# EAGLE design temp-stellwerk-laser-4 (EAGLE 9.6.2)
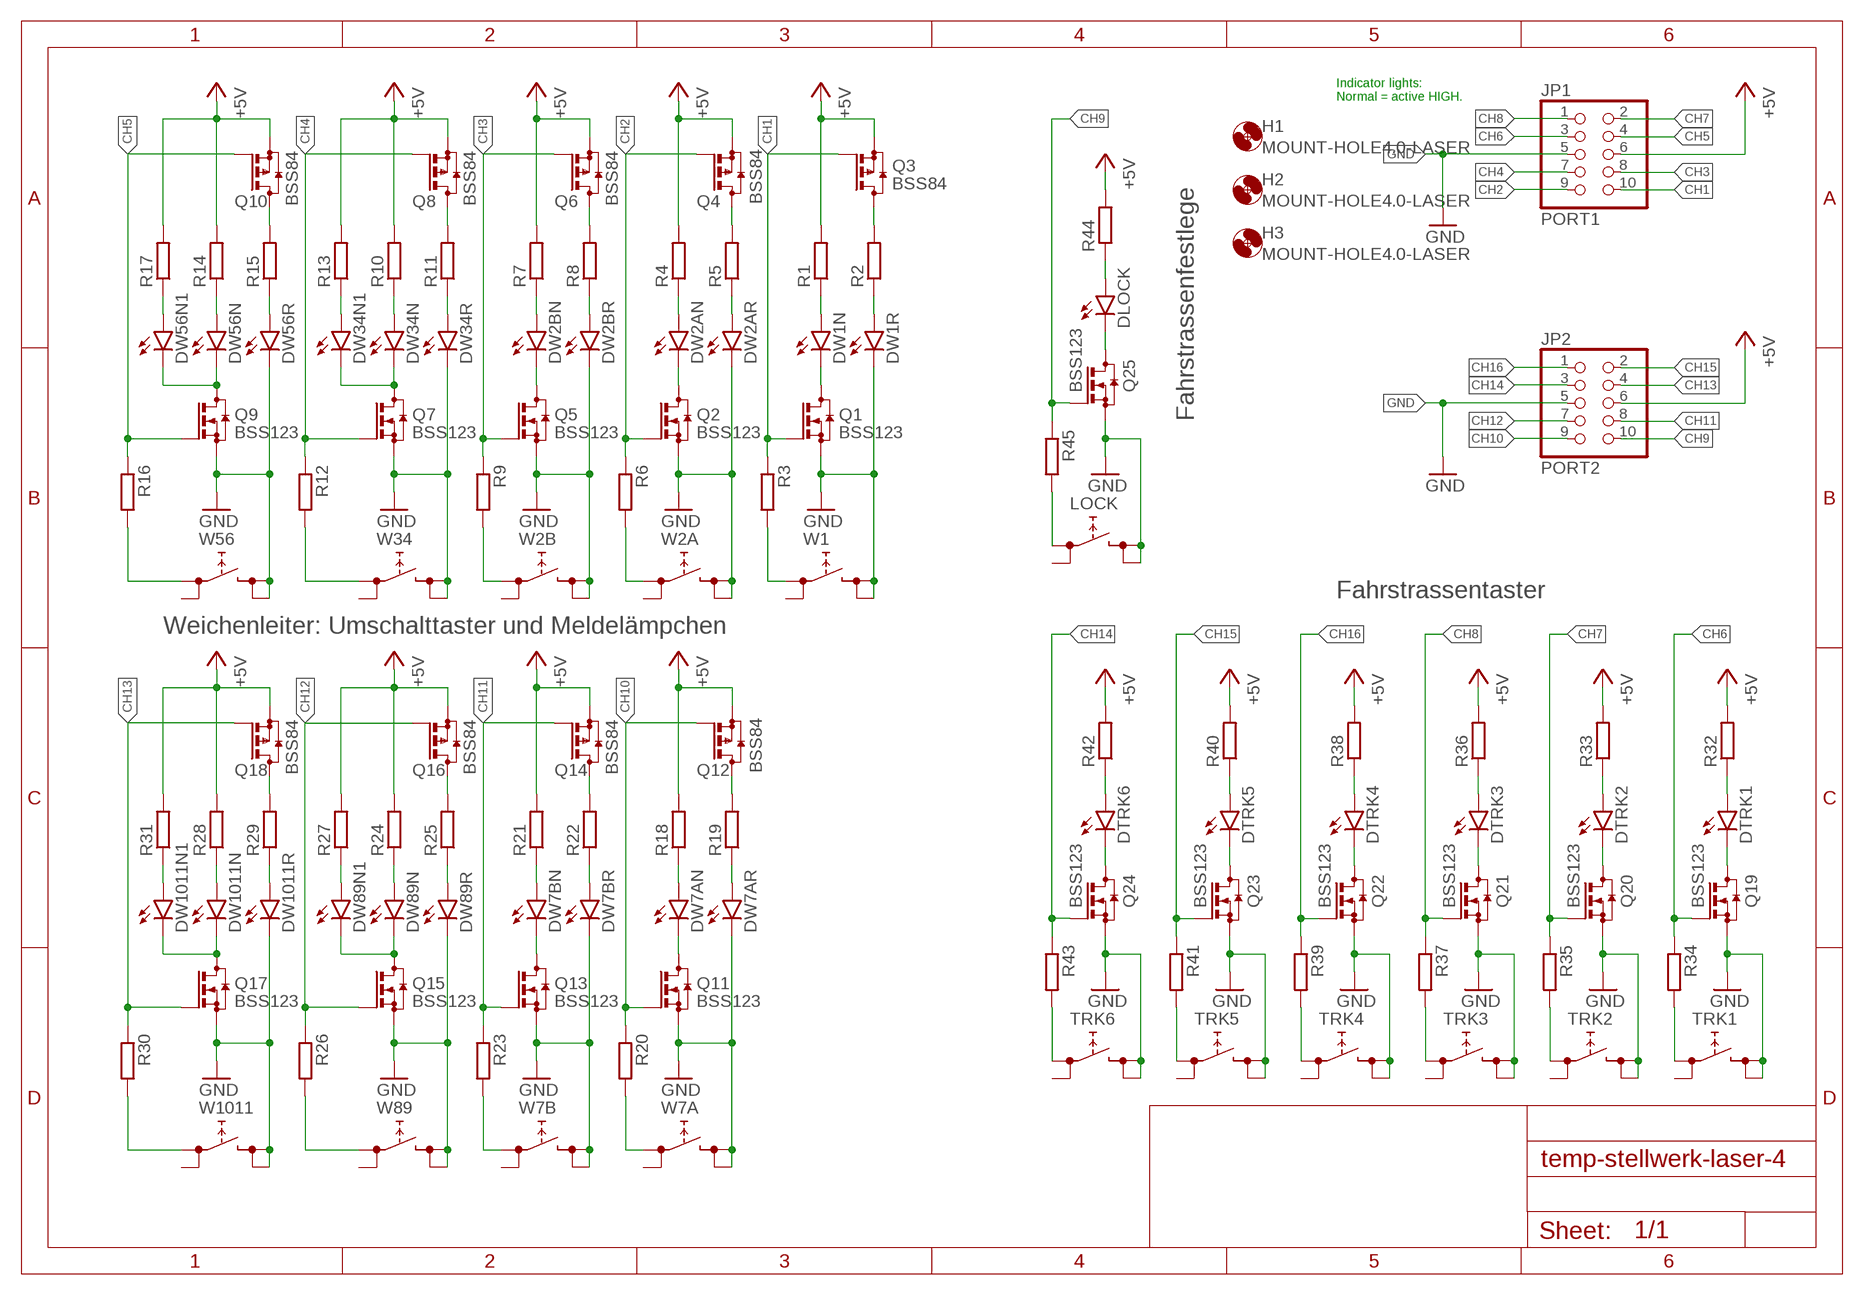
[diagram p0: schematic, sheet 1]

## Parts
DLOCK  LEDCHIPLED_0805  [CHIPLED_0805]
DTRK1  LEDCHIPLED_0805  [CHIPLED_0805]
DTRK2  LEDCHIPLED_0805  [CHIPLED_0805]
DTRK3  LEDCHIPLED_0805  [CHIPLED_0805]
DTRK4  LEDCHIPLED_0805  [CHIPLED_0805]
DTRK5  LEDCHIPLED_0805  [CHIPLED_0805]
DTRK6  LEDCHIPLED_0805  [CHIPLED_0805]
DW1N  LEDCHIPLED_0603  [CHIPLED_0603]
DW1R  LEDCHIPLED_0603  [CHIPLED_0603]
DW2AN  LEDCHIPLED_0603  [CHIPLED_0603]
DW2AR  LEDCHIPLED_0603  [CHIPLED_0603]
DW2BN  LEDCHIPLED_0805  [CHIPLED_0805]
DW2BR  LEDCHIPLED_0805  [CHIPLED_0805]
DW7AN  LEDCHIPLED_0603  [CHIPLED_0603]
DW7AR  LEDCHIPLED_0603  [CHIPLED_0603]
DW7BN  LEDCHIPLED_0805  [CHIPLED_0805]
DW7BR  LEDCHIPLED_0805  [CHIPLED_0805]
DW34N  LEDCHIPLED_0805  [CHIPLED_0805]
DW34N1  LEDCHIPLED_0805  [CHIPLED_0805]
DW34R  LEDCHIPLED_0805  [CHIPLED_0805]
DW56N  LEDCHIPLED_0805  [CHIPLED_0805]
DW56N1  LEDCHIPLED_0805  [CHIPLED_0805]
DW56R  LEDCHIPLED_0805  [CHIPLED_0805]
DW89N  LEDCHIPLED_0805  [CHIPLED_0805]
DW89N1  LEDCHIPLED_0805  [CHIPLED_0805]
DW89R  LEDCHIPLED_0805  [CHIPLED_0805]
DW1011N  LEDCHIPLED_0805  [CHIPLED_0805]
DW1011N1  LEDCHIPLED_0805  [CHIPLED_0805]
DW1011R  LEDCHIPLED_0805  [CHIPLED_0805]
H1  MOUNT-HOLE4.0-LASER  [MOUNT-HOLE-3.2-4.0-LASER]
H2  MOUNT-HOLE4.0-LASER  [MOUNT-HOLE-3.2-4.0-LASER]
H3  MOUNT-HOLE4.0-LASER  [MOUNT-HOLE-3.2-4.0-LASER]
JP1  PORT1  PINHD-2X5CN  [CON10M]
JP2  PORT2  PINHD-2X5CN  [CON10M]
LOCK  LOCK  TACTSW-6X6S  [TACTSW-6X6-LASER]
Q1  BSS123  [SOT23-NCH]
Q2  BSS123  [SOT23-NCH]
Q3  BSS84  [SOT23]
Q4  BSS84  [SOT23]
Q5  BSS123  [SOT23-NCH]
Q6  BSS84  [SOT23]
Q7  BSS123  [SOT23-NCH]
Q8  BSS84  [SOT23]
Q9  BSS123  [SOT23-NCH]
Q10  BSS84  [SOT23]
Q11  BSS123  [SOT23-NCH]
Q12  BSS84  [SOT23]
Q13  BSS123  [SOT23-NCH]
Q14  BSS84  [SOT23]
Q15  BSS123  [SOT23-NCH]
Q16  BSS84  [SOT23]
Q17  BSS123  [SOT23-NCH]
Q18  BSS84  [SOT23]
Q19  BSS123  [SOT23-NCH]
Q20  BSS123  [SOT23-NCH]
Q21  BSS123  [SOT23-NCH]
Q22  BSS123  [SOT23-NCH]
Q23  BSS123  [SOT23-NCH]
Q24  BSS123  [SOT23-NCH]
Q25  BSS123  [SOT23-NCH]
R1  R-EU_R0805  [R0805]
R2  R-EU_R0805  [R0805]
R3  R-EU_R0805  [R0805]
R4  R-EU_R0805  [R0805]
R5  R-EU_R0805  [R0805]
R6  R-EU_R0805  [R0805]
R7  R-EU_R0805  [R0805]
R8  R-EU_R0805  [R0805]
R9  R-EU_R0805  [R0805]
R10  R-EU_R0805  [R0805]
R11  R-EU_R0805  [R0805]
R12  R-EU_R0805  [R0805]
R13  R-EU_R0805  [R0805]
R14  R-EU_R0805  [R0805]
R15  R-EU_R0805  [R0805]
R16  R-EU_R0805  [R0805]
R17  R-EU_R0805  [R0805]
R18  R-EU_R0805  [R0805]
R19  R-EU_R0805  [R0805]
R20  R-EU_R0805  [R0805]
R21  R-EU_R0805  [R0805]
R22  R-EU_R0805  [R0805]
R23  R-EU_R0805  [R0805]
R24  R-EU_R0805  [R0805]
R25  R-EU_R0805  [R0805]
R26  R-EU_R0805  [R0805]
R27  R-EU_R0805  [R0805]
R28  R-EU_R0805  [R0805]
R29  R-EU_R0805  [R0805]
R30  R-EU_R0805  [R0805]
R31  R-EU_R0805  [R0805]
R32  R-EU_R0805  [R0805]
R33  R-EU_R0805  [R0805]
R34  R-EU_R0805  [R0805]
R35  R-EU_R0805  [R0805]
R36  R-EU_R0805  [R0805]
R37  R-EU_R0805  [R0805]
R38  R-EU_R0805  [R0805]
R39  R-EU_R0805  [R0805]
R40  R-EU_R0805  [R0805]
R41  R-EU_R0805  [R0805]
R42  R-EU_R0805  [R0805]
R43  R-EU_R0805  [R0805]
R44  R-EU_R0805  [R0805]
R45  R-EU_R0805  [R0805]
TRK1  TACTSW-6X6S  [TACTSW-6X6-LASER]
TRK2  TACTSW-6X6S  [TACTSW-6X6-LASER]
TRK3  TACTSW-6X6S  [TACTSW-6X6-LASER]
TRK4  TACTSW-6X6S  [TACTSW-6X6-LASER]
TRK5  TACTSW-6X6S  [TACTSW-6X6-LASER]
TRK6  TACTSW-6X6S  [TACTSW-6X6-LASER]
W1  W1  TACTSW-6X6S  [TACTSW-6X6-LASER]
W2A  TACTSW-6X6S  [TACTSW-6X6-LASER]
W2B  TACTSW-6X6S  [TACTSW-6X6-LASER]
W7A  TACTSW-6X6S  [TACTSW-6X6-LASER]
W7B  TACTSW-6X6S  [TACTSW-6X6-LASER]
W34  XOVER  TACTSW-6X6S  [TACTSW-6X6-LASER]
W56  XOVER  TACTSW-6X6S  [TACTSW-6X6-LASER]
W89  XOVER  TACTSW-6X6S  [TACTSW-6X6-LASER]
W1011  XOVER  TACTSW-6X6S  [TACTSW-6X6-LASER]

## Nets
+5V: JP1.6 JP2.6 Q3.2(S) Q4.2(S) Q6.2(S) Q8.2(S) Q10.2(S) Q12.2(S) Q14.2(S) Q16.2(S) Q18.2(S) R1.2 R4.2 R7.2 R10.2 R13.2 R14.2 R17.2 R18.2 R21.2 R24.2 R27.2 R28.2 R31.2 R32.2 R33.2 R36.2 R38.2 R40.2 R42.2 R44.2
CH1: JP1.10 Q1.1(G) Q3.1(G) R3.1
CH2: JP1.9 Q2.1(G) Q4.1(G) R6.1
CH3: JP1.8 Q5.1(G) Q6.1(G) R9.1
CH4: JP1.7 Q7.1(G) Q8.1(G) R12.1
CH5: JP1.4 Q9.1(G) Q10.1(G) R16.1
CH6: JP1.3 Q19.1(G) R34.1
CH7: JP1.2 Q20.1(G) R35.1
CH8: JP1.1 Q21.1(G) R37.1
CH9: JP2.10 Q25.1(G) R45.1
CH10: JP2.9 Q11.1(G) Q12.1(G) R20.1
CH11: JP2.8 Q13.1(G) Q14.1(G) R23.1
CH12: JP2.7 Q15.1(G) Q16.1(G) R26.1
CH13: JP2.4 Q17.1(G) Q18.1(G) R30.1
CH14: JP2.3 Q24.1(G) R43.1
CH15: JP2.2 Q23.1(G) R41.1
CH16: JP2.1 Q22.1(G) R39.1
GND: DW1R.C DW2AR.C DW2BR.C DW7AR.C DW7BR.C DW34R.C DW56R.C DW89R.C DW1011R.C JP1.5 JP2.5 LOCK.3(2.1) LOCK.4(2.2) Q1.2(S) Q2.2(S) Q5.2(S) Q7.2(S) Q9.2(S) Q11.2(S) Q13.2(S) Q15.2(S) Q17.2(S) Q19.2(S) Q20.2(S) Q21.2(S) Q22.2(S) Q23.2(S) Q24.2(S) Q25.2(S) TRK1.3(2.1) TRK1.4(2.2) TRK2.3(2.1) TRK2.4(2.2) TRK3.3(2.1) TRK3.4(2.2) TRK4.3(2.1) TRK4.4(2.2) TRK5.3(2.1) TRK5.4(2.2) TRK6.3(2.1) TRK6.4(2.2) W1.3(2.1) W1.4(2.2) W2A.3(2.1) W2A.4(2.2) W2B.3(2.1) W2B.4(2.2) W7A.3(2.1) W7A.4(2.2) W7B.3(2.1) W7B.4(2.2) W34.3(2.1) W34.4(2.2) W56.3(2.1) W56.4(2.2) W89.3(2.1) W89.4(2.2) W1011.3(2.1) W1011.4(2.2)
N$1: DTRK1.C Q19.3(D)
N$2: DW1N.C Q1.3(D)
N$3: DW1N.A R1.1
N$4: DW1R.A R2.1
N$5: Q3.3(D) R2.2
N$6: DW2AN.C Q2.3(D)
N$8: R3.2 W1.1(1.1)
N$9: DW2AN.A R4.1
N$10: DW2AR.A R5.1
N$11: Q4.3(D) R5.2
N$13: R6.2 W2A.1(1.1)
N$14: DW2BN.C Q5.3(D)
N$15: DW2BN.A R7.1
N$16: DW2BR.A R8.1
N$17: Q6.3(D) R8.2
N$19: R9.2 W2B.1(1.1)
N$20: DW56N.A R14.1
N$21: DW34N.A R10.1
N$22: DW34R.A R11.1
N$23: Q8.3(D) R11.2
N$25: R12.2 W34.1(1.1)
N$26: DW34N1.C DW34N.C Q7.3(D)
N$27: DW34N1.A R13.1
N$28: DW56R.A R15.1
N$29: Q10.3(D) R15.2
N$31: R16.2 W56.1(1.1)
N$32: DW56N1.C DW56N.C Q9.3(D)
N$33: DW56N1.A R17.1
N$34: DW7AN.C Q11.3(D)
N$35: DW7AN.A R18.1
N$36: DW7AR.A R19.1
N$37: Q12.3(D) R19.2
N$39: R20.2 W7A.1(1.1)
N$40: DW7BN.C Q13.3(D)
N$41: DW7BN.A R21.1
N$42: DW7BR.A R22.1
N$43: Q14.3(D) R22.2
N$45: R23.2 W7B.1(1.1)
N$46: DW89N.A R24.1
N$47: DW89R.A R25.1
N$48: Q16.3(D) R25.2
N$50: R26.2 W89.1(1.1)
N$51: DW89N1.C DW89N.C Q15.3(D)
N$52: DW89N1.A R27.1
N$53: DW1011N.A R28.1
N$54: DW1011R.A R29.1
N$55: Q18.3(D) R29.2
N$57: R30.2 W1011.1(1.1)
N$58: DW1011N1.C DW1011N.C Q17.3(D)
N$59: DW1011N1.A R31.1
N$60: DTRK1.A R32.1
N$61: DTRK2.C Q20.3(D)
N$62: DTRK2.A R33.1
N$64: R34.2 TRK1.1(1.1)
N$66: R35.2 TRK2.1(1.1)
N$67: DTRK3.C Q21.3(D)
N$68: DTRK3.A R36.1
N$70: R37.2 TRK3.1(1.1)
N$71: DTRK4.C Q22.3(D)
N$72: DTRK4.A R38.1
N$74: R39.2 TRK4.1(1.1)
N$75: DTRK5.C Q23.3(D)
N$76: DTRK5.A R40.1
N$78: R41.2 TRK5.1(1.1)
N$79: DTRK6.C Q24.3(D)
N$80: DTRK6.A R42.1
N$82: R43.2 TRK6.1(1.1)
N$83: DLOCK.C Q25.3(D)
N$84: DLOCK.A R44.1
N$86: LOCK.1(1.1) R45.2
Unconnected: LOCK.2(1.2) TRK1.2(1.2) TRK2.2(1.2) TRK3.2(1.2) TRK4.2(1.2) TRK5.2(1.2) TRK6.2(1.2) W1.2(1.2) W2A.2(1.2) W2B.2(1.2) W7A.2(1.2) W7B.2(1.2) W34.2(1.2) W56.2(1.2) W89.2(1.2) W1011.2(1.2)

## Notes on the sheet
- Indicator lights:
  Normal = active HIGH.
- Fahrstrassenfestlege
- Fahrstrassentaster
- Weichenleiter: Umschalttaster und Meldelämpchen

## Library data of the parts
DLOCK DTRK1-DTRK6 DW1N DW1R DW2AN DW2AR DW2BN DW2BR DW7AN DW7AR DW7BN DW7BR DW34N DW34N1 DW34R DW56N DW56N1 DW56R DW89N DW89N1 DW89R DW1011N DW1011N1 DW1011R = eagleparts:LED: LED OSRAM: - CHIPLED LG R971, LG N971, LY N971, LG Q971, LY Q971, LO R971, LY R971 LH N974, LH R974 LS Q976, LO Q976, LY Q976 LO Q996 - Hyper CHIPLED LW Q18S LB Q993, LB Q99A, LB R99A - SideLED LS A670, LO A670, LY A670, LG A670, LP A670 LB A673, LV A673, LT A673, LW A673 LH A674 LY A675 LS A676, LA A676, LO A676, LY A676, LW A676 LS A679, LY A679, LG A679 - Hyper Micro SIDELED® LS Y876, LA Y876, LO Y876, LY Y876 LT Y87S - SmartLED LW L88C, LW L88S LB L89C, LB L89S, LG L890 LS L89K, LO L89K, LY L89K LS L896, LA L896, LO L896, LY L896 - TOPLED LS T670, LO T670, LY T670, LG T670, LP T670 LSG T670, LSP T670, LSY T670, LOP T670, LYG T670 LG T671, LOG T671, LSG T671 LB T673, LV T673, LT T673, LW T673 LH T674 LS T676, LA T676, LO T676, LY T676, LB T676, LH T676, LSB T676, LW T676 LB T67C, LV T67C, LT T67C, LS T67K, LO T67K, LY T67K, LW E67C LS E67B, LA E67B, LO E67B, LY E67B, LB E67C, LV E67C, LT E67C LW T67C LS T679, LY T679, LG T679 LS T770, LO T770, LY T770, LG T770, LP T770 LB T773, LV T773, LT T773, LW T773 LH T774 LS E675, LA E675, LY E675, LS T675 LS T776, LA T776, LO T776, LY T776, LB T776 LHGB T686 LT T68C, LB T68C - Hyper Mini TOPLED® LB M676 - Mini TOPLED Santana® LG M470 LS M47K, LO M47K, LY M47K Source: http://www.osram.convergy.de LUXEON: - LUMILED® LXK2-PW12-R00, LXK2-PW12-S00, LXK2-PW14-U00, LXK2-PW14-V00 LXK2-PM12-R00, LXK2-PM12-S00, LXK2-PM14-U00 LXK2-PE12-Q00, LXK2-PE12-R00, LXK2-PE12-S00, LXK2-PE14-T00, LXK2-PE14-U00 LXK2-PB12-K00, LXK2-PB12-L00, LXK2-PB12-M00, LXK2-PB14-N00, LXK2-PB14-P00, LXK2-PB14-Q00 LXK2-PR12-L00, LXK2-PR12-M00, LXK2-PR14-Q00, LXK2-PR14-R00 LXK2-PD12-Q00, LXK2-PD12-R00, LXK2-PD12-S00 LXK2-PH12-R00, LXK2-PH12-S00 LXK2-PL12-P00, LXK2-PL12-Q00, LXK2-PL12-R00 Source: www.luxeon.com KINGBRIGHT: KA-3528ASYC Source: www.kingbright.com
H1-H3 = eagleparts:MOUNT-HOLE
JP1 JP2 = trainlib:PINHD-2X5: PIN HEADER
LOCK TRK1-TRK6 W1 W2A W2B W7A W7B W34 W56 W89 W1011 = eagleparts:TACTSW-6X6: 6.2 X 6.5mm TACT Switch (SMD) Source: http://www3.alps.co.jp/WebObjects/catalog.woa/PDF/E/Switch/Tact/SKHM/SKHM.PDF
Q1 Q2 Q5 Q7 Q9 Q11 Q13 Q15 Q17 Q19-Q25 = eagleparts:BSS123: N-CHANNEL MOS FET
Q3 Q4 Q6 Q8 Q10 Q12 Q14 Q16 Q18 = transistor-small-signal:BSS84: P-CHANNEL MOS FET
R1-R45 = rcl:R-EU_: RESISTOR, European symbol; SPICEPREFIX: R

## Net classes
0 default: width 0.254 mm, clearance 0.203 mm

## Board
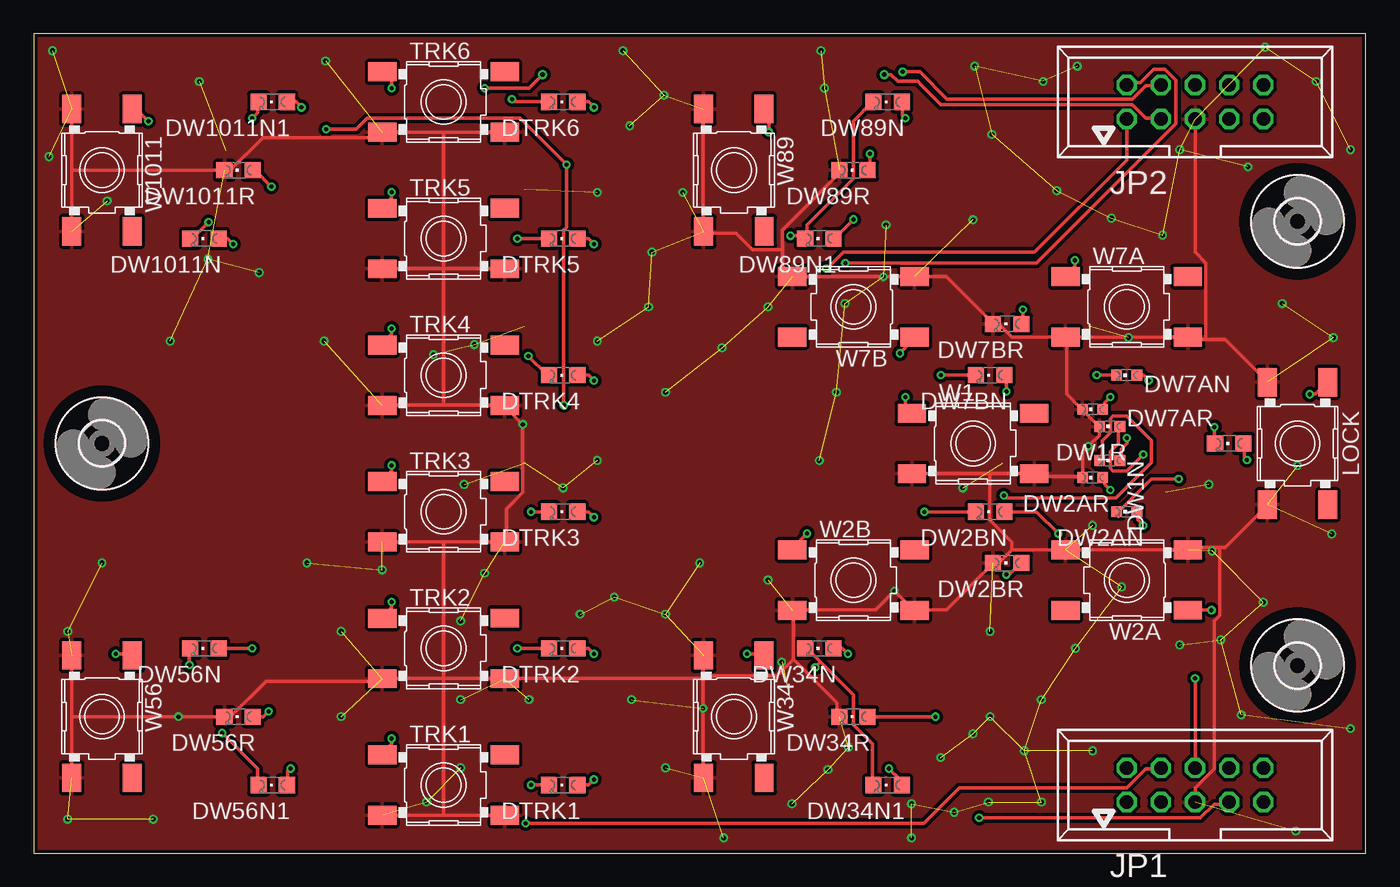
[diagram p1: board, top side]
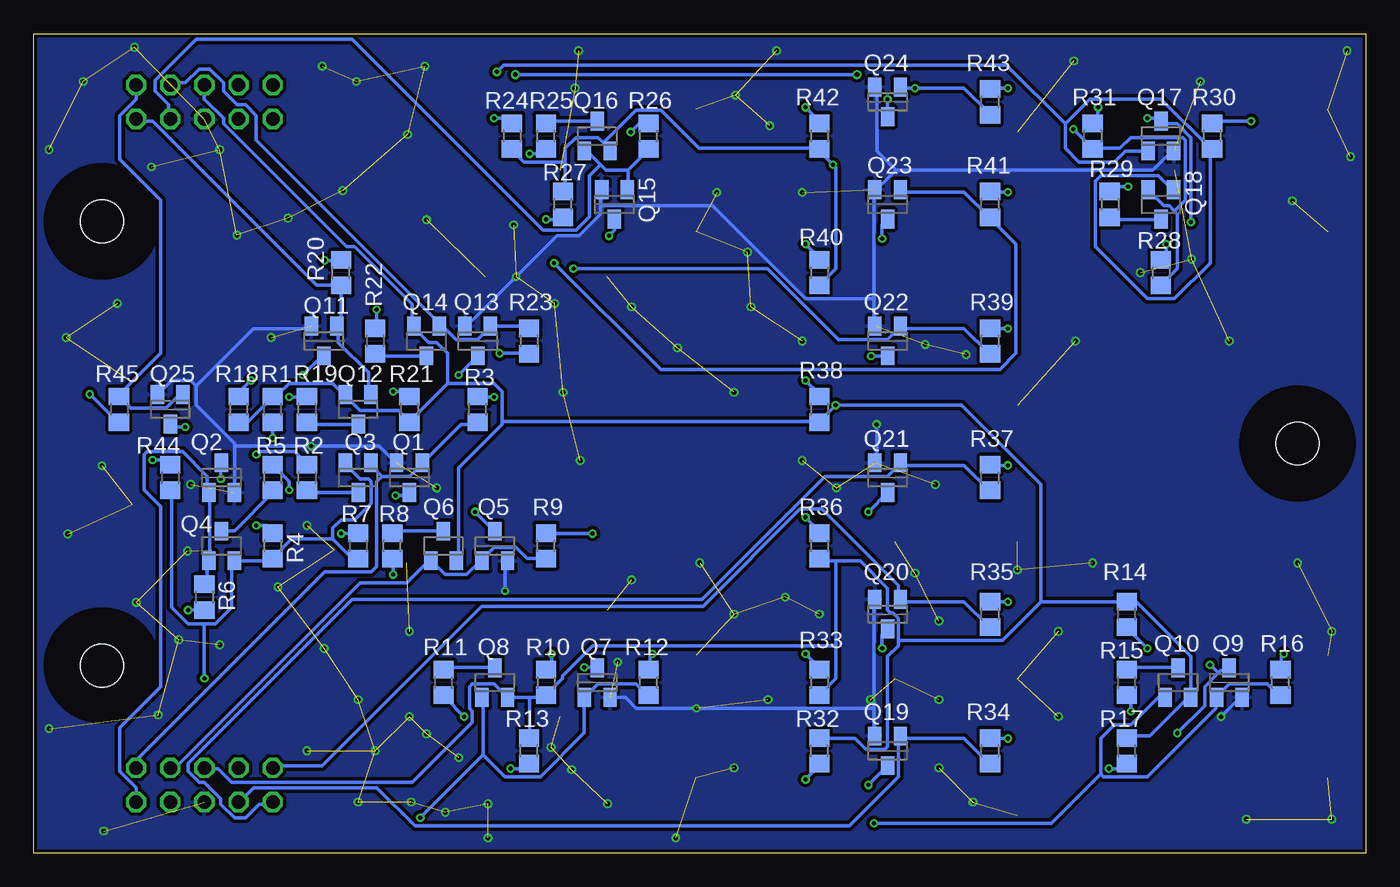
[diagram p2: board, bottom side, seen from below]

Size 99.06 x 60.96 mm. Coordinates in mm from the lower left corner, seen from the top.
Outline: 0,0 99.06,0 99.06,60.96 0,60.96 0,0
Copper layers (1*16): Top 0.035mm / dielectric 1.5mm / Bottom 0.035mm
Design rules "Fusion_eagle_rule_v1.1": minimum track width 6mil, minimum drill 12mil, track to track 6mil, track to pad 6mil, pad to pad 6mil, via to via 6mil, smd to smd 0mil, copper to edge 10mil, drill to drill 10mil, minimum pad ring 10mil, minimum via ring 6mil, stop-mask expansion 2mil, vias tented up to drill 100mil, thermal gap 10mil

### Footprints (pad centres in the part's own frame; a part is rotated, then mirrored left to right if it is on the bottom)
CHIPLED_0805 = smd 1.2 x 1.2: A 0,-1.05; C 0,1.05
CHIPLED_0603 = smd 0.8 x 0.8: A 0,-0.75; C 0,0.75
MOUNT-HOLE-3.2-4.0-LASER = hole 3.2: 0,0
CON10M = drill 1 octagon: 1 -5.08,-1.27; 2 -5.08,1.27; 3 -2.54,-1.27; 4 -2.54,1.27; 5 0,-1.27; 6 0,1.27; 7 2.54,-1.27; 8 2.54,1.27; 9 5.08,-1.27; 10 5.08,1.27
TACTSW-6X6-LASER = smd 2.1 x 1.4: 1 -4.55,2.24; 2 4.55,2.25; 3 -4.55,-2.25; 4 4.55,-2.25
SOT23-NCH = smd 1 x 1.4: 1 -0.95,-1.1; 2 0.95,-1.1; 3 0,1.1
SOT23 = smd 1 x 1.4: 1 -0.95,-1.1; 2 0.95,-1.1; 3 0,1.1
R0805 = smd 1.3 x 1.5: 1 -0.95,0; 2 0.95,0

### Placement (x,y rotation side)
DLOCK  88.9,30.48 90 top
DTRK1  39.37,5.08 90 top
DTRK2  39.37,15.24 90 top
DTRK3  39.37,25.4 90 top
DTRK4  39.37,35.56 90 top
DTRK5  39.37,45.72 90 top
DTRK6  39.37,55.88 90 top
DW1N  80.01,29.21 90 top
DW1R  80.01,31.75 90 top
DW2AN  81.28,25.4 90 top
DW2AR  78.74,27.94 90 top
DW2BN  71.12,25.4 90 top
DW2BR  72.39,21.59 90 top
DW7AN  81.28,35.56 90 top
DW7AR  78.74,33.02 90 top
DW7BN  71.12,35.56 90 top
DW7BR  72.39,39.37 90 top
DW34N  58.42,15.24 90 top
DW34N1  63.5,5.08 90 top
DW34R  60.96,10.16 90 top
DW56N  12.7,15.24 90 top
DW56N1  17.78,5.08 90 top
DW56R  15.24,10.16 90 top
DW89N  63.5,55.88 90 top
DW89N1  58.42,45.72 90 top
DW89R  60.96,50.8 90 top
DW1011N  12.7,45.72 90 top
DW1011N1  17.78,55.88 90 top
DW1011R  15.24,50.8 90 top
H1  93.98,46.99 0 top
H2  93.98,13.97 0 top
H3  5.08,30.48 0 top
JP1  86.36,5.08 0 top
JP2  86.36,55.88 0 top
LOCK  93.98,30.48 270 top
Q1  71.12,27.94 180 bottom
Q2  85.09,27.94 0 bottom
Q3  74.93,27.94 180 bottom
Q4  85.09,22.86 0 bottom
Q5  64.77,22.86 0 bottom
Q6  68.58,22.86 0 bottom
Q7  57.15,12.7 0 bottom
Q8  64.77,12.7 0 bottom
Q9  10.16,12.7 0 bottom
Q10  13.97,12.7 0 bottom
Q11  77.47,38.1 180 bottom
Q12  74.93,33.02 180 bottom
Q13  66.04,38.1 180 bottom
Q14  69.85,38.1 180 bottom
Q15  55.88,48.26 180 bottom
Q16  57.15,53.34 0 bottom
Q17  15.24,53.34 0 bottom
Q18  15.24,48.26 180 bottom
Q19  35.56,7.62 180 bottom
Q20  35.56,17.78 180 bottom
Q21  35.56,27.94 180 bottom
Q22  35.56,38.1 180 bottom
Q23  35.56,48.26 180 bottom
Q24  35.56,55.88 180 bottom
Q25  88.9,33.02 180 bottom
R1  81.28,33.02 90 bottom
R2  78.74,27.94 270 bottom
R3  66.04,33.02 90 bottom
R4  81.28,22.86 270 bottom
R5  81.28,27.94 270 bottom
R6  86.36,19.05 270 bottom
R7  74.93,22.86 270 bottom
R8  72.39,22.86 90 bottom
R9  60.96,22.86 90 bottom
R10  60.96,12.7 270 bottom
R11  68.58,12.7 90 bottom
R12  53.34,12.7 90 bottom
R13  62.23,7.62 90 bottom
R14  17.78,17.78 90 bottom
R15  17.78,12.7 90 bottom
R16  6.35,12.7 90 bottom
R17  17.78,7.62 90 bottom
R18  83.82,33.02 270 bottom
R19  78.74,33.02 270 bottom
R20  76.2,43.18 90 bottom
R21  71.12,33.02 270 bottom
R22  73.66,38.1 270 bottom
R23  62.23,38.1 270 bottom
R24  63.5,53.34 270 bottom
R25  60.96,53.34 90 bottom
R26  53.34,53.34 90 bottom
R27  59.69,48.26 90 bottom
R28  15.24,43.18 270 bottom
R29  19.05,48.26 270 bottom
R30  11.43,53.34 90 bottom
R31  20.32,53.34 270 bottom
R32  40.64,7.62 90 bottom
R33  40.64,12.7 270 bottom
R34  27.94,7.62 90 bottom
R35  27.94,17.78 90 bottom
R36  40.64,22.86 270 bottom
R37  27.94,27.94 90 bottom
R38  40.64,33.02 270 bottom
R39  27.94,38.1 90 bottom
R40  40.64,43.18 270 bottom
R41  27.94,48.26 90 bottom
R42  40.64,53.34 270 bottom
R43  27.94,55.88 90 bottom
R44  88.9,27.94 270 bottom
R45  92.71,33.02 270 bottom
TRK1  30.48,5.08 0 top
TRK2  30.48,15.24 0 top
TRK3  30.48,25.4 0 top
TRK4  30.48,35.56 0 top
TRK5  30.48,45.72 0 top
TRK6  30.48,55.88 0 top
W1  69.85,30.48 0 top
W2A  81.28,20.32 180 top
W2B  60.96,20.32 0 top
W7A  81.28,40.64 0 top
W7B  60.96,40.64 180 top
W34  52.07,10.16 270 top
W56  5.08,10.16 270 top
W89  52.07,50.8 270 top
W1011  5.08,50.8 270 top

### Tracks (layer width: path | path; a pad name or v marks a point on that pad's centre or on a via)
+5V  (via drill 0.3)
  Top 0.254: JP1.6 v86.36,13.01 | v21.74,53.85 23.98,53.85 24.79,54.66 36.17,54.66 v39.62,51.21 39.62,46.53 39.42,46.33 v39.42,33.33
  Bottom 0.254: R17.2 17.68,8.74 16.05,8.74 13.21,11.58 Q10.2 13.01,11.79 13.01,14.63 17.07,18.69 17.68,18.69 R14.2 17.88,18.69 24.18,18.69 | 34.75,15.85 34.75,17.48 35.15,17.88 35.36,17.88 35.56,18.09 35.56,19.71 37.59,21.74 39.42,21.74 | 34.75,15.85 34.75,15.44 35.56,14.63 35.56,7.92 35.76,7.72 37.19,7.72 38,8.53 40.64,8.53 R32.2 | 39.42,21.74 40.64,21.74 R36.2 | 39.42,21.74 39.42,15.44 | 39.42,15.44 39.42,13.01 40.64,11.79 R33.2 | 24.18,18.69 27.03,15.85 34.75,15.85 | 76.81,23.37 76.81,24.18 76.2,24.79 75.18,24.79 73.97,26.01 73.97,27.64 74.17,27.84 74.78,27.84 75.79,28.85 Q3.2 | 76.81,23.37 75.39,21.95 74.98,21.95 R7.2 | 86.36,17.07 85.55,17.07 84.33,18.29 84.33,21.74 Q4.2 84.12,21.74 81.28,21.74 R4.2 81.28,21.95 79.86,23.37 76.81,23.37 | 86.36,17.07 87.58,17.07 88.8,18.29 88.8,26.82 R44.2 | 62.18,11.58 60.96,11.58 R10.2 60.96,11.79 59.74,13.01 59.74,13.21 57.51,15.44 39.42,15.44 | 62.18,11.58 63.8,11.58 Q8.2 64.01,11.79 64.82,12.6 66.45,12.6 66.65,12.39 66.65,10.77 66.45,10.57 66.45,9.75 70.92,5.28 84.33,5.28 85.34,6.3 86.36,6.3 JP1.6 | 62.18,11.58 62.18,8.74 R13.2 | v86.36,13.01 86.36,17.07 | 14.22,47.75 14.02,47.55 14.02,43.48 15.24,42.27 R28.2 | 14.22,47.75 14.63,48.16 15.04,48.16 16.05,49.17 Q18.2 | 20.32,52.43 18.29,52.43 17.48,53.24 13.61,53.24 13.41,53.03 13.41,48.56 14.22,47.75 | R40.2 40.64,42.27 39.42,43.48 39.42,51 v39.62,51.21 40.64,52.22 R42.2 40.64,52.43 49.58,52.43 52.43,55.27 54.25,55.27 56.69,52.83 | 56.69,52.83 57.1,53.24 58.73,53.24 59.54,52.43 59.54,51.41 | 56.69,52.83 56.29,52.43 Q16.2 56.69,52.83 | 59.54,51.41 59.54,49.38 R27.2
  Bottom 0.254: 59.54,51.41 62.59,51.41 63.4,52.22 R24.2 | v21.74,53.85 20.32,52.43 | 20.32,52.43 R31.2 | R18.2 83.72,32.11 83.11,32.11 81.28,33.93 R1.2 81.28,34.14 80.87,34.14 80.06,34.95 76.81,34.95 76,34.14 Q12.2 75.79,33.93 74.78,32.92 71.93,32.92 71.12,32.11 | 64.21,32.11 64.21,34.34 64.82,34.95 68.28,34.95 | 64.21,32.11 64.21,31.9 67.46,28.65 67.46,21.95 Q6.2 | 71.12,32.11 68.28,34.95 | 71.12,32.11 R21.2 | 68.28,34.95 68.28,37.19 69.09,38 69.7,38 70.71,39.01 Q14.2 70.92,39.22 70.92,40.84 75.18,45.11 75.79,45.11 84.94,54.25 84.94,54.66 86.36,56.08 JP2.6 | 64.21,32.11 40.64,32.11 | 40.64,32.11 v39.42,33.33 30.07,33.33 24.18,27.43 24.18,18.69 | 40.64,32.11 R38.2
CH1
  Bottom 0.254: 73.15,28.04 71.12,28.04 70.31,28.85 Q1.1 70.1,29.06 67.26,31.9 66.04,31.9 R3.1 | 73.15,28.04 73.97,28.85 Q3.1 | JP1.10 91.44,6.91 77.42,20.93 73.97,20.93 73.56,21.34 73.56,27.64 73.15,28.04
CH2
  Bottom 0.254: R6.1 86.36,20.12 86.16,20.32 86.16,21.74 Q4.1 85.95,21.95 85.95,26.82 Q2.1 86.16,27.03 86.16,28.04 87.99,29.87 90.63,29.87 90.83,29.67 90.83,27.03 89.61,25.81 89.61,12.39 92.66,9.35 92.66,6.1 91.44,4.88 JP1.9
CH3
  Bottom 0.254: R9.1 60.96,21.95 62.38,21.95 63.2,22.76 64.82,22.76 65.63,21.95 Q5.1 65.84,21.74 66.85,20.73 68.48,20.73 69.49,21.74 Q6.1 69.7,21.74 71.32,20.12 74.78,20.12 88.39,6.5 88.8,6.5 JP1.8
CH4  (via drill 0.3)
  Top 0.254: v70.31,2.64 86.77,2.64 87.78,3.66 88.8,3.66 JP1.7
  Bottom 0.254: R12.1 53.44,11.79 54.25,12.6 57.1,12.6 57.91,11.79 Q7.1 58.12,11.58 58.12,8.94 61.37,5.69 64.01,5.69 65.63,7.32 | 65.63,7.32 65.63,11.58 Q8.1 | 65.63,7.32 v70.31,2.64
CH5  (via drill 0.3)
  Top 0.254: v36.58,2.23 66.19,2.23 68.83,4.88 81.28,4.88 82.7,6.3 83.72,6.3 JP1.4
  Bottom 0.254: R16.1 6.5,11.79 7.32,12.6 10.16,12.6 10.97,11.79 Q9.1 11.18,11.58 11.18,10.77 16.26,5.69 19.51,5.69 19.71,5.89 | 19.71,5.89 19.71,8.53 18.69,9.55 17.48,9.55 15.44,11.58 15.04,11.58 Q10.1 | v36.58,2.23 23.37,2.23 19.71,5.89
CH6
  Bottom 0.254: R34.1 28.04,6.71 29.87,8.53 34.54,8.53 Q19.1 34.75,8.53 34.75,5.69 38.41,2.03 70.71,2.03 73.56,4.88 82.7,4.88 83.72,3.86 JP1.3
CH7
  Bottom 0.254: R35.1 28.04,16.87 29.87,18.69 34.54,18.69 Q20.1 34.75,18.9 34.75,19.91 40.44,25.6 42.06,25.6 49.3,18.36 65.76,18.36 77.62,6.5 81.28,6.5 JP1.2
CH8
  Bottom 0.254: R37.1 28.04,27.03 29.87,28.85 34.54,28.85 Q21.1 34.75,28.85 35.56,28.04 40.23,28.04 49.38,18.9 75.39,18.9 87.58,6.71 87.58,6.1 86.77,5.28 86.36,5.28 85.14,4.06 85.14,3.66 84.12,2.64 83.31,2.64 82.3,3.66 81.28,3.66 JP1.1
CH9
  Bottom 0.254: Q25.1 87.99,33.93 88.39,33.93 89.2,33.12 91.85,33.12 92.66,33.93 R45.1 92.66,34.14 89.61,37.19 89.61,48.56 92.66,51.61 92.66,54.86 91.44,56.08 JP2.10
CH10
  Bottom 0.254: Q12.1 74.17,34.14 74.17,35.76 76.4,38 76.4,39.01 Q11.1 76.4,39.22 76.2,39.42 R20.1 76.2,42.27 78.03,42.27 90.22,54.46 91.44,54.46 JP2.9
CH11
  Bottom 0.254: R23.1 62.38,39.22 65.02,39.22 Q13.1 65.23,39.01 66.04,38.2 67.67,38.2 68.48,39.01 68.89,39.01 Q14.1 69.09,39.22 69.09,39.62 82.5,53.03 82.5,54.86 83.31,55.68 83.92,55.68 84.94,56.69 84.94,57.3 85.95,58.32 86.77,58.32 87.78,57.3 88.8,57.3 JP2.8
CH12
  Bottom 0.254: 54.86,50.8 54.86,49.38 Q15.1 | 54.86,50.8 53.44,52.22 R26.1 | 56.9,51.21 56.49,50.8 54.86,50.8 | 56.9,51.21 57.91,52.22 Q16.1 | 56.9,51.21 57.71,50.39 57.71,47.35 58.73,46.33 61.16,46.33 75.39,60.55 86.97,60.55 90.02,57.51 90.02,56.69 89,55.68 89,54.66 JP2.7
CH13  (via drill 0.3)
  Top 0.254: v64.62,58.12 65.89,58.12 67.92,56.08 81.69,56.08 82.7,57.1 83.72,57.1 JP2.4
  Bottom 0.254: Q18.1 14.43,49.38 15.44,50.39 19.71,50.39 20.12,49.99 20.12,45.11 16.26,41.25 14.22,41.25 11.58,43.89 11.58,52.22 R30.1 11.58,52.43 15.24,56.08 20.52,56.08 22.35,54.25 | 22.35,54.25 22.35,52.43 21.34,51.41 18.69,51.41 17.88,52.22 16.26,52.22 Q17.1 | v64.62,58.12 64.11,58.62 26.72,58.62 22.35,54.25
CH14  (via drill 0.3, 0.35)
  Top 0.254: v33.53,56.9 36.83,56.9 v37.85,57.91 | JP2.3 83.72,54.66 82.7,54.66 81.69,55.68 67.46,55.68 65.99,57.15 65.76,57.4 64.26,57.4 63.75,57.91 v63.25,57.91
  Bottom 0.254: Q24.1 34.54,56.9 v33.53,56.9 29.87,56.9 28.04,55.07 R43.1 | v63.25,57.91 v37.85,57.91
CH15  (via drill 0.3)
  Top 0.254: v60.35,43.89 74.57,43.89 84.94,54.25 84.94,57.51 84.12,58.32 83.31,58.32 82.3,57.3 81.28,57.3 JP2.2
  Bottom 0.254: Q23.1 34.54,49.17 29.87,49.17 28.04,47.35 R41.1 27.84,47.14 26.01,45.31 26.01,37.19 27.23,35.97 52.43,35.97 v60.35,43.89
CH16  (via drill 0.3)
  Top 0.254: 81.28,54.46 JP2.1 81.28,51.56 74.42,44.7 60.2,44.7 58.98,43.48 v58.93,43.48
  Bottom 0.254: R39.1 28.04,37.19 29.87,39.01 34.54,39.01 Q22.1 34.75,39.01 35.56,38.2 39.22,38.2 44.5,43.48 v58.93,43.48
GND  (via drill 0.3, 0.35)  (99 unrouted)
  Top 0.254: 2.85,50.8 2.85,55.27 W1011.3 | 2.85,50.8 2.85,46.33 W1011.4 | 30.48,43.48 34.95,43.48 TRK5.4 | 30.48,43.48 26.01,43.48 TRK5.3 | 30.48,53.65 26.01,53.65 TRK6.3 25.81,53.44 25.6,53.24 17.07,53.24 14.63,50.8 DW1011R.C 2.85,50.8 | 30.48,53.65 34.95,53.65 TRK6.4 | 30.48,53.65 30.48,43.48 | 30.48,23.16 34.95,23.16 TRK3.4 35.15,23.16 35.15,25.6 36.37,26.82 v36.37,31.9 35.15,33.12 TRK4.4 34.95,33.33 30.48,33.33 | 30.48,23.16 26.01,23.16 TRK3.3 | 30.48,33.33 26.01,33.33 TRK4.3 | 2.85,10.16 2.85,14.63 W56.3 | 2.85,10.16 2.85,5.69 W56.4 | 30.48,2.85 34.95,2.85 TRK1.4 | 30.48,2.85 26.01,2.85 TRK1.3 | 30.48,13.01 26.01,13.01 TRK2.3 25.81,12.8 17.27,12.8 14.63,10.16 DW56R.C v10.77,10.16 2.85,10.16 | 30.48,13.01 34.95,13.01 TRK2.4 35.15,13.01 49.78,13.01 | 30.48,13.01 30.48,2.85 | 30.48,13.01 30.48,23.16 | 30.48,33.33 30.48,43.48 | 88.19,22.76 88.59,22.76 91.64,25.81 LOCK.4 | 88.19,22.76 85.95,22.76 W2A.3 85.75,22.55 76.81,22.55 W2A.4 76.61,22.55 72.75,22.55 | JP1.5 86.36,4.88 87.78,6.3 87.78,17.27 88.19,17.68 88.19,22.76 | 87.17,38.2 88.59,38.2 91.64,35.15 LOCK.3 | 87.17,38.2 85.95,38.2 W7A.4 85.75,38.41 76.81,38.41 W7A.3 | JP2.5 86.36,44.7 87.17,43.89 87.17,38.2 | 55.68,44.91 55.68,43.69 56.29,43.08 W7B.4 56.49,42.88 v63.2,42.88 65.43,42.88 W7B.3 65.63,42.88 67.87,42.88 71.32,39.42 DW7BR.C 71.53,39.22 71.93,39.22 72.75,38.41 76.61,38.41 W7A.3 | 55.68,44.91 55.68,46.33 59.74,50.39 59.74,50.8 DW89R.C | 55.68,44.91 53.44,44.91 52.22,46.13 49.99,46.13 W89.4 49.78,46.33 49.78,55.27 W89.3 | 49.78,13.21 49.78,14.63 W34.3 | 49.78,13.21 49.78,13.01 | 49.78,13.01 v49.78,10.77 49.78,5.69 W34.4
  Top 0.254: 56.49,14.43 59.74,11.18 59.74,10.16 DW34R.C | 56.49,14.43 56.49,17.88 W2B.3 56.49,18.09 62.59,18.09 v64.01,19.51 65.43,18.09 W2B.4 65.63,18.09 67.87,18.09 71.32,21.54 DW2BR.C 71.53,21.74 71.93,21.74 72.75,22.55 | 49.78,13.21 55.27,13.21 56.49,14.43 | 79.25,31.7 78.03,32.92 DW7AR.C 77.83,33.12 76.81,34.14 76.81,38.2 W7A.3 | 79.25,31.7 79.25,31.09 v78.44,30.28 78.03,29.87 78.03,28.04 DW2AR.C 77.83,28.04 74.57,28.04 W1.4 74.37,28.25 71.12,28.25 | 79.25,31.7 DW1R.C | 71.12,28.25 65.43,28.25 W1.3 | 72.75,22.55 72.75,23.16 71.12,24.79 71.12,28.25
  Bottom 0.254: v36.37,31.9 36.37,29.06 Q21.2 | v10.77,10.16 9.35,11.58 Q9.2 | 56.9,48.16 56.9,49.17 Q15.2 | 56.9,48.16 56.9,47.55 58.52,45.92 60.15,45.92 v63.2,42.88 66.85,39.22 Q13.2 | 36.58,41.25 36.58,49.17 Q23.2 36.37,49.38 34.95,50.8 | 36.58,41.25 36.58,39.22 Q22.2 | 34.95,50.8 15.85,50.8 14.43,52.22 Q17.2 | 34.95,50.8 36.37,52.22 36.37,56.9 Q24.2 | 56.9,48.16 48.56,48.16 41.66,41.25 36.58,41.25 | 84.12,30.28 84.12,30.48 86.97,33.33 86.97,34.75 | 84.12,30.28 84.12,27.03 Q2.2 | 86.97,34.75 87.38,35.15 88.8,35.15 89.81,34.14 Q25.2 | 84.12,30.28 v78.44,30.28 73.36,30.28 72.14,29.06 Q1.2 | 86.97,34.75 82.7,39.01 78.44,39.01 Q11.2 | 36.58,10.77 36.58,18.69 Q20.2 | 36.58,10.77 36.58,8.74 Q19.2 | 36.58,10.77 v49.78,10.77 54.25,10.77 55.07,11.58 56.08,11.58 Q7.2 | v64.01,19.51 64.01,21.74 Q5.2
  other vias: 10.16,38.1 21.59,38.1 20.32,21.59 5.08,21.59 22.86,16.51 22.86,10.16 31.75,11.43 8.89,2.54 2.54,2.54 2.54,16.51 31.75,6.35 29.21,3.81 36.83,11.43 44.45,11.43 46.99,6.35 43.18,19.05 46.99,17.78 40.64,17.78 49.53,21.59 54.61,20.32 71.12,16.51 77.47,15.24 74.93,11.43 78.74,7.62 73.66,7.62 71.12,10.16 69.85,8.89 67.44,7.11 74.93,3.81 70.99,3.81 68.45,3.05 65.28,3.68 65.28,1.14 51.31,1.14 56.39,3.68 59.05,6.22 60.58,7.87 58.42,29.21 41.91,29.21 41.91,38.1 45.72,40.64 54.61,40.64 51.18,37.59 59.69,34.29 46.99,34.29 60.33,40.89 69.85,47.12 63.37,46.74 76.07,49.28 71.25,53.47 69.98,58.55 77.6,58.55 75.06,57.4 80.14,47.24 85.22,52.32 83.95,45.97 90.3,51.05 95.38,57.4 91.57,59.94 97.92,52.32 92.84,40.89 96.65,38.35 81.41,38.35 85.22,15.49 80.9,19.81 88.27,15.88 89.79,10.29 87.38,27.43 87.63,22.48 96.52,23.75 91.44,18.67 93.98,28.83 41.91,49.15 48.26,49.15 45.97,44.7 44.32,54.1 46.86,56.39 58.8,56.9 58.55,59.69 43.81,59.69 21.72,58.93 12.32,57.4 1.14,51.82 5.46,48.51 1.4,59.69 93.85,1.65 97.92,9.27 25.91,21.08 33.53,20.83 32,27.43 39.37,27.18 32.77,37.85 29.72,37.08 69.09,27.18 78.74,24.38 31.75,17.27 55.63,14.22 16.76,43.18 12.95,44.2
  pour Top (isolate 0.254): 0,60.96 99.06,60.96 99.06,0 0,0
  pour Bottom (isolate 0.254): 0,60.96 99.06,60.96 99.06,0 0,0
N$1  (via drill 0.3)
  Top 0.254: v36.98,5.08 DTRK1.C
  Bottom 0.254: v36.98,5.08 35.56,6.5 Q19.3
N$2  (via drill 0.3)
  Top 0.254: v72.14,26.62 72.34,26.42 80.47,26.42 83.11,29.06 83.11,30.68 81.28,32.51 80.26,32.51 80.06,32.31 80.06,31.29 79.45,30.68 79.45,29.26 DW1N.C
  Bottom 0.254: v72.14,26.62 71.32,26.62 71.12,26.82 Q1.3
N$3  (via drill 0.3)
  Top 0.254: v81.28,30.89 81.28,30.48 80.87,30.07 80.87,29.26 DW1N.A
  Bottom 0.254: R1.1 v81.28,30.89
N$4  (via drill 0.3)
  Top 0.254: v82.5,29.67 81.28,28.45 80.26,28.45 80.06,28.65 80.06,29.87 80.67,30.48 80.67,31.7 DW1R.A
  Bottom 0.254: v82.5,29.67 82.3,29.87 79.65,29.87 78.84,29.06 R2.1
N$5
  Bottom 0.254: Q3.3 74.98,26.82 78.64,26.82 R2.2
N$6  (via drill 0.3)
  Top 0.254: v85.14,27.84 83.11,27.84 80.67,25.4 DW2AN.C
  Bottom 0.254: v85.14,27.84 85.14,28.85 Q2.3
N$8  (via drill 0.3)
  Top 0.254: v64.82,33.93 64.82,33.33 65.23,32.92 W1.1
  Bottom 0.254: v64.82,33.93 66.04,33.93 R3.2
N$9  (via drill 0.3)
  Top 0.254: v82.5,24.38 82.09,24.79 82.09,25.4 DW2AN.A
  Bottom 0.254: v82.5,24.38 81.69,24.38 81.28,23.98 R4.1
N$10  (via drill 0.3)
  Top 0.254: v80.06,27.03 79.65,27.43 79.65,27.84 DW2AR.A
  Bottom 0.254: v80.06,27.03 80.06,27.64 81.28,28.85 R5.1
N$11
  Bottom 0.254: Q4.3 84.94,23.98 84.12,23.98 81.28,26.82 R5.2
N$13  (via drill 0.3)
  Top 0.254: v87.58,18.09 85.95,18.09 W2A.1
  Bottom 0.254: v87.58,18.09 86.36,18.09 R6.2
N$14  (via drill 0.3)
  Top 0.254: v66.24,25.4 DW2BN.C
  Bottom 0.254: v66.24,25.4 64.82,23.98 Q5.3
N$15  (via drill 0.3)
  Top 0.254: DW2BN.A 74.57,25.4 v76.2,23.77
  Bottom 0.254: v76.2,23.77 74.98,23.77 R7.1
N$16  (via drill 0.3)
  Top 0.254: v72.34,20.73 72.54,20.73 73.36,21.54 DW2BR.A
  Bottom 0.254: v72.34,20.73 72.34,21.74 R8.1
N$17
  Bottom 0.254: Q6.3 68.68,23.98 72.34,23.98 R8.2
N$19  (via drill 0.3)
  Top 0.254: v57.51,23.77 56.49,22.76 W2B.1
  Bottom 0.254: v57.51,23.77 60.96,23.77 R9.2
N$20  (via drill 0.3)
  Top 0.254: v16.26,15.24 DW56N.A
  Bottom 0.254: v16.26,15.24 17.68,16.66 R14.1
N$21  (via drill 0.3)
  Top 0.254: DW34N.A 60.15,15.24 v60.55,14.83
  Bottom 0.254: v60.55,14.83 60.55,14.22 60.96,13.82 R10.1
N$22  (via drill 0.3)
  Top 0.254: v67.06,10.16 DW34R.A
  Bottom 0.254: v67.06,10.16 68.48,11.58 R11.1
N$23
  Bottom 0.254: Q8.3 64.82,13.82 68.48,13.82 R11.2
N$25  (via drill 0.3)
  Top 0.254: v53.03,14.83 54.25,14.83 W34.1
  Bottom 0.254: v53.03,14.83 53.24,14.63 53.24,13.82 R12.2
N$26  (via drill 0.3)
  Top 0.254: 58.52,14.22 57.51,15.24 DW34N.C | 58.52,14.22 60.96,11.79 60.96,9.55 62.38,8.13 62.38,5.08 DW34N1.C | 58.52,14.22 v58.12,13.82
  Bottom 0.254: v58.12,13.82 57.3,13.82 Q7.3
N$27  (via drill 0.3)
  Top 0.254: v63.6,6.3 64.41,5.49 64.41,5.08 DW34N1.A
  Bottom 0.254: v63.6,6.3 62.59,6.3 62.38,6.5 R13.1
N$28  (via drill 0.3)
  Top 0.254: DW56R.A 17.07,10.16 v17.48,10.57
  Bottom 0.254: v17.48,10.57 17.48,11.38 17.68,11.58 R15.1
N$29
  Bottom 0.254: Q10.3 14.02,13.82 17.68,13.82 R15.2
N$31  (via drill 0.3)
  Top 0.254: v6.1,14.83 7.32,14.83 W56.1
  Bottom 0.254: v6.1,14.83 6.3,14.63 6.3,13.82 R16.2
N$32  (via drill 0.3)
  Top 0.254: v14.02,8.94 16.66,6.3 16.66,5.08 DW56N1.C | v11.58,14.02 11.58,15.24 DW56N.C
  Bottom 0.254: v14.02,8.94 11.99,10.97 11.99,12.39 10.97,13.41 | 10.97,13.41 10.77,13.61 10.16,13.61 Q9.3 | 10.97,13.41 v11.58,14.02
N$33  (via drill 0.3)
  Top 0.254: v19.1,6.3 18.9,6.1 18.9,5.08 DW56N1.A
  Bottom 0.254: v19.1,6.3 18.09,6.3 17.88,6.5 R17.1
N$34  (via drill 0.3)
  Top 0.254: v79.05,35.56 DW7AN.C
  Bottom 0.254: v79.05,35.56 77.62,36.98 Q11.3
N$35  (via drill 0.3)
  Top 0.254: DW7AN.A 82.5,35.56 v82.91,35.15
  Bottom 0.254: v82.91,35.15 83.92,34.14 R18.1
N$36  (via drill 0.3)
  Top 0.254: v80.06,33.93 79.65,33.53 79.65,33.12 DW7AR.A
  Bottom 0.254: v80.06,33.93 78.84,33.93 R19.1
N$37
  Bottom 0.254: Q12.3 74.98,31.9 78.64,31.9 R19.2
N$39  (via drill 0.3)
  Top 0.254: v77.42,44.09 77.42,43.69 76.81,43.08 W7A.1
  Bottom 0.254: v77.42,44.09 76.2,44.09 R20.2
N$40  (via drill 0.3)
  Top 0.254: v67.46,35.56 DW7BN.C
  Bottom 0.254: v67.46,35.56 66.04,36.98 Q13.3
N$41  (via drill 0.3)
  Top 0.254: v72.34,34.34 72.34,35.56 DW7BN.A
  Bottom 0.254: v72.34,34.34 71.32,34.34 71.12,34.14 R21.1
N$42  (via drill 0.3)
  Top 0.254: v73.56,40.44 73.56,39.42 DW7BR.A
  Bottom 0.254: v73.56,40.44 73.56,39.22 R22.1
N$43
  Bottom 0.254: Q14.3 69.9,36.98 73.56,36.98 R22.2
N$45  (via drill 0.3)
  Top 0.254: v64.41,37.19 65.43,38.2 W7B.1
  Bottom 0.254: v64.41,37.19 62.38,37.19 R23.2
N$46  (via drill 0.3)
  Top 0.254: v64.82,54.66 64.62,54.86 64.62,55.88 DW89N.A
  Bottom 0.254: v64.82,54.66 63.8,54.66 63.6,54.46 R24.1
N$47  (via drill 0.3)
  Top 0.254: v62.18,52.02 62.18,50.8 DW89R.A
  Bottom 0.254: v62.18,52.02 61.16,52.02 60.96,52.22 R25.1
N$48
  Bottom 0.254: Q16.3 57.3,54.46 60.96,54.46 R25.2
N$50  (via drill 0.3)
  Top 0.254: v54.66,53.65 54.66,55.07 54.46,55.27 W89.1
  Bottom 0.254: v54.66,53.65 54.05,54.25 53.44,54.25 R26.2
N$51  (via drill 0.3)
  Top 0.254: 57.51,45.92 57.51,46.74 60.96,50.19 60.96,54.46 62.38,55.88 DW89N.C | 57.51,45.92 57.51,45.72 DW89N1.C 57.51,45.92 | 57.51,45.92 v56.29,45.92
  Bottom 0.254: Q15.3 55.88,46.33 v56.29,45.92
N$52  (via drill 0.3)
  Top 0.254: v60.96,47.14 59.54,45.72 DW89N1.A
  Bottom 0.254: v60.96,47.14 59.74,47.14 R27.1
N$53  (via drill 0.3)
  Top 0.254: DW1011N.A 14.43,45.72 v14.83,45.31
  Bottom 0.254: v14.83,45.31 14.83,44.7 15.24,44.3 R28.1
N$54  (via drill 0.3)
  Top 0.254: v17.68,49.58 16.46,50.8 DW1011R.A
  Bottom 0.254: v17.68,49.58 18.69,49.58 18.9,49.38 R29.1
N$55
  Bottom 0.254: Q18.3 15.24,47.14 18.9,47.14 R29.2
N$57  (via drill 0.3)
  Top 0.254: v8.53,54.46 7.52,55.47 W1011.1
  Bottom 0.254: v8.53,54.46 11.38,54.46 R30.2
N$58  (via drill 0.3)
  Top 0.254: v13.01,46.94 11.79,45.72 DW1011N.C | v16.26,54.66 16.66,55.07 16.66,55.88 DW1011N1.C
  Bottom 0.254: v13.01,46.94 13.01,53.24 14.02,54.25 15.24,54.25 Q17.3 15.24,54.46 15.44,54.66 v16.26,54.66
N$59  (via drill 0.3)
  Top 0.254: DW1011N1.A 19.51,55.88 v19.91,55.47
  Bottom 0.254: v19.91,55.47 19.91,54.86 20.32,54.46 R31.1
N$60  (via drill 0.3)
  Top 0.254: DTRK1.A 41.25,5.08 v41.66,5.49
  Bottom 0.254: v41.66,5.49 40.64,6.5 R32.1
N$61  (via drill 0.3)
  Top 0.254: v35.97,15.24 DTRK2.C
  Bottom 0.254: v35.97,15.24 35.97,16.26 35.56,16.66 Q20.3
N$62  (via drill 0.3)
  Top 0.254: DTRK2.A 41.25,15.24 v41.66,14.83
  Bottom 0.254: v41.66,14.83 40.64,13.82 R33.1
N$64  (via drill 0.3)
  Top 0.254: v26.62,8.53 26.62,8.13 26.01,7.52 TRK1.1
  Bottom 0.254: v26.62,8.53 27.84,8.53 R34.2
N$66  (via drill 0.3)
  Top 0.254: v26.62,18.69 26.62,18.29 26.01,17.68 TRK2.1
  Bottom 0.254: v26.62,18.69 27.84,18.69 R35.2
N$67  (via drill 0.3)
  Top 0.254: v36.98,25.4 DTRK3.C
  Bottom 0.254: v36.98,25.4 35.56,26.82 Q21.3
N$68  (via drill 0.3)
  Top 0.254: DTRK3.A 41.25,25.4 v41.66,24.99
  Bottom 0.254: v41.66,24.99 40.64,23.98 R36.1
N$70  (via drill 0.3)
  Top 0.254: v26.62,28.85 26.62,28.45 26.01,27.84 TRK3.1
  Bottom 0.254: v26.62,28.85 27.84,28.85 R37.2
N$71  (via drill 0.3)
  Top 0.254: v36.78,36.98 38.2,35.56 DTRK4.C
  Bottom 0.254: v36.78,36.98 35.56,36.98 Q22.3
N$72  (via drill 0.3)
  Top 0.254: DTRK4.A 41.25,35.56 v41.66,35.15
  Bottom 0.254: v41.66,35.15 40.64,34.14 R38.1
N$74  (via drill 0.3)
  Top 0.254: v26.62,39.01 26.62,38.61 26.01,38 TRK4.1
  Bottom 0.254: v26.62,39.01 27.84,39.01 R39.2
N$75  (via drill 0.3)
  Top 0.254: v35.97,45.72 DTRK5.C
  Bottom 0.254: v35.97,45.72 35.97,46.74 35.56,47.14 Q23.3
N$76  (via drill 0.3)
  Top 0.254: DTRK5.A 41.25,45.72 v41.66,45.31
  Bottom 0.254: v41.66,45.31 40.64,44.3 R40.1
N$78  (via drill 0.3)
  Top 0.254: v26.62,49.17 26.62,48.77 26.01,48.16 TRK5.1
  Bottom 0.254: v26.62,49.17 27.84,49.17 R41.2
N$79  (via drill 0.3)
  Top 0.254: DTRK6.C 35.76,55.88 v35.56,56.08
  Bottom 0.254: Q24.3 v35.56,56.08
N$80  (via drill 0.3)
  Top 0.254: DTRK6.A 41.25,55.88 v41.66,55.47
  Bottom 0.254: v41.66,55.47 40.64,54.46 R42.1
N$82  (via drill 0.3)
  Top 0.254: v26.62,56.9 26.62,57.51 26.01,58.12 TRK6.1
  Bottom 0.254: v26.62,56.9 27.84,56.9 R43.2
N$83  (via drill 0.3)
  Top 0.254: v87.78,31.7 87.78,30.48 DLOCK.C
  Bottom 0.254: v87.78,31.7 88.59,31.7 88.8,31.9 Q25.3
N$84  (via drill 0.3)
  Top 0.254: v90.22,29.26 90.02,29.46 90.02,30.48 DLOCK.A
  Bottom 0.254: v90.22,29.26 89.2,29.26 89,29.06 R44.1
N$86  (via drill 0.3)
  Top 0.254: v94.89,34.14 95.3,34.14 96.11,34.95 LOCK.1
  Bottom 0.254: v94.89,34.14 92.86,32.11 R45.2

### Text on the board
laser-etch: (10/11) | (8/9) | (7b) | (7a) | (1) | (2b) | (2a) | (5/6) | (3/4) | Fdl